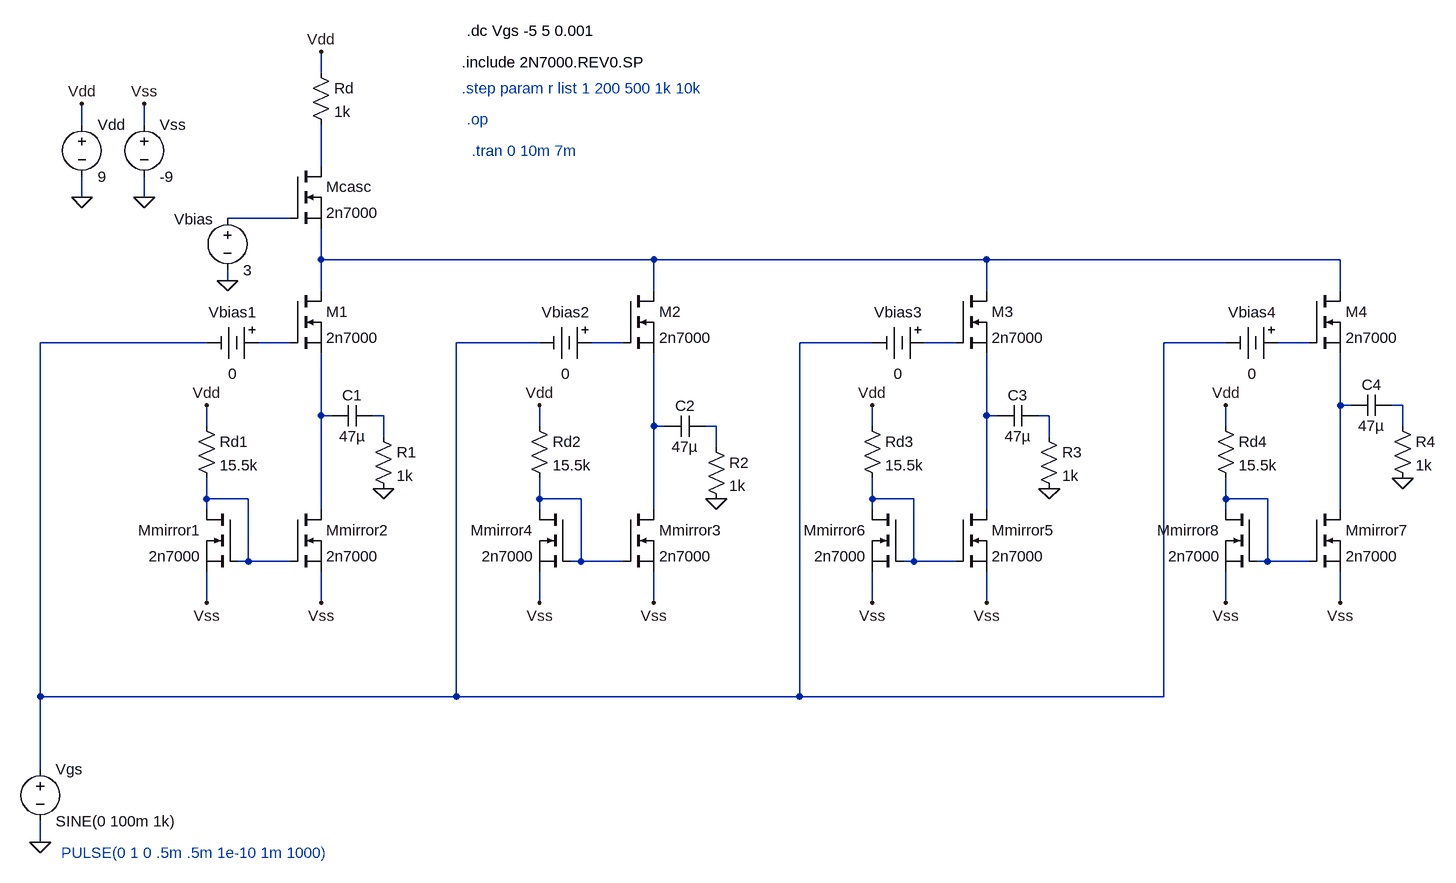
[diagram p0: schematic the circuit complete.asc]
the circuit complete.asc, the LTspice schematic file:
Version 4
SHEET 1 1940 1168
WIRE 208 -192 208 -224
WIRE -160 -112 -160 -144
WIRE -64 -112 -64 -144
WIRE 208 -48 208 -112
WIRE -160 0 -160 -32
WIRE -64 0 -64 -32
WIRE 160 32 64 32
WIRE 208 96 208 48
WIRE 720 96 208 96
WIRE 1232 96 720 96
WIRE 1776 96 1232 96
WIRE 64 128 64 112
WIRE 208 144 208 96
WIRE 720 144 720 96
WIRE 1232 144 1232 96
WIRE 1776 144 1776 96
WIRE 32 224 -224 224
WIRE 160 224 112 224
WIRE 544 224 416 224
WIRE 672 224 624 224
WIRE 1056 224 944 224
WIRE 1184 224 1136 224
WIRE 1600 224 1504 224
WIRE 1728 224 1680 224
WIRE 1776 320 1776 240
WIRE 1792 320 1776 320
WIRE 1872 320 1856 320
WIRE 208 336 208 240
WIRE 224 336 208 336
WIRE 304 336 288 336
WIRE 1232 336 1232 240
WIRE 1248 336 1232 336
WIRE 1328 336 1312 336
WIRE 32 352 32 320
WIRE 544 352 544 320
WIRE 720 352 720 240
WIRE 736 352 720 352
WIRE 816 352 800 352
WIRE 1056 352 1056 320
WIRE 1600 352 1600 320
WIRE 1872 352 1872 320
WIRE 304 368 304 336
WIRE 1328 368 1328 336
WIRE 816 384 816 352
WIRE 32 464 32 432
WIRE 96 464 32 464
WIRE 544 464 544 432
WIRE 608 464 544 464
WIRE 1056 464 1056 432
WIRE 1120 464 1056 464
WIRE 1600 464 1600 432
WIRE 1664 464 1600 464
WIRE 32 480 32 464
WIRE 208 480 208 336
WIRE 544 480 544 464
WIRE 720 480 720 352
WIRE 1056 480 1056 464
WIRE 1232 480 1232 336
WIRE 1600 480 1600 464
WIRE 1776 480 1776 320
WIRE 96 560 96 464
WIRE 96 560 80 560
WIRE 160 560 96 560
WIRE 608 560 608 464
WIRE 608 560 592 560
WIRE 672 560 608 560
WIRE 1120 560 1120 464
WIRE 1120 560 1104 560
WIRE 1184 560 1120 560
WIRE 1664 560 1664 464
WIRE 1664 560 1648 560
WIRE 1728 560 1664 560
WIRE 32 624 32 576
WIRE 208 624 208 576
WIRE 544 624 544 576
WIRE 720 624 720 576
WIRE 1056 624 1056 576
WIRE 1232 624 1232 576
WIRE 1600 624 1600 576
WIRE 1776 624 1776 576
WIRE -224 768 -224 224
WIRE 416 768 416 224
WIRE 416 768 -224 768
WIRE 944 768 944 224
WIRE 944 768 416 768
WIRE 1504 768 1504 224
WIRE 1504 768 944 768
WIRE -224 880 -224 768
WIRE -224 992 -224 960
FLAG -224 992 0
FLAG -160 0 0
FLAG -160 -144 Vdd
FLAG 208 -224 Vdd
FLAG 64 128 0
FLAG -64 0 0
FLAG -64 -144 Vss
FLAG 32 320 Vdd
FLAG 32 624 Vss
FLAG 208 624 Vss
FLAG 544 320 Vdd
FLAG 544 624 Vss
FLAG 720 624 Vss
FLAG 1056 320 Vdd
FLAG 1056 624 Vss
FLAG 1232 624 Vss
FLAG 1600 320 Vdd
FLAG 1600 624 Vss
FLAG 1776 624 Vss
FLAG 304 448 0
FLAG 816 464 0
FLAG 1328 448 0
FLAG 1872 432 0
SYMBOL nmos 160 144 R0
SYMATTR InstName M1
SYMATTR Value 2n7000
SYMATTR Prefix X
SYMBOL voltage -224 864 R0
WINDOW 123 0 0 Left 2
WINDOW 39 0 0 Left 2
SYMATTR InstName Vgs
SYMATTR Value SINE(0 100m 1k)
SYMBOL voltage -160 -128 R0
WINDOW 123 0 0 Left 2
WINDOW 39 0 0 Left 2
SYMATTR InstName Vdd
SYMATTR Value 9
SYMBOL res 192 -208 R0
SYMATTR InstName Rd
SYMATTR Value 1k
SYMBOL nmos 160 -48 R0
SYMATTR InstName Mcasc
SYMATTR Value 2n7000
SYMATTR Prefix X
SYMBOL voltage 64 16 R0
WINDOW 0 -82 18 Left 2
WINDOW 123 0 0 Left 2
WINDOW 39 0 0 Left 2
SYMATTR InstName Vbias
SYMATTR Value 3
SYMBOL battery 128 224 R90
WINDOW 0 -32 56 VBottom 2
WINDOW 3 32 56 VTop 2
SYMATTR InstName Vbias1
SYMATTR Value 0
SYMBOL nmos 160 480 R0
SYMATTR InstName Mmirror2
SYMATTR Value 2n7000
SYMATTR Prefix X
SYMBOL nmos 80 480 M0
SYMATTR InstName Mmirror1
SYMATTR Value 2n7000
SYMATTR Prefix X
SYMBOL voltage -64 -128 R0
WINDOW 123 0 0 Left 2
WINDOW 39 0 0 Left 2
SYMATTR InstName Vss
SYMATTR Value -9
SYMBOL res 16 336 R0
SYMATTR InstName Rd1
SYMATTR Value 15.5k
SYMBOL nmos 672 144 R0
SYMATTR InstName M2
SYMATTR Value 2n7000
SYMATTR Prefix X
SYMBOL battery 640 224 R90
WINDOW 0 -32 56 VBottom 2
WINDOW 3 32 56 VTop 2
SYMATTR InstName Vbias2
SYMATTR Value 0
SYMBOL nmos 672 480 R0
SYMATTR InstName Mmirror3
SYMATTR Value 2n7000
SYMATTR Prefix X
SYMBOL nmos 592 480 M0
SYMATTR InstName Mmirror4
SYMATTR Value 2n7000
SYMATTR Prefix X
SYMBOL res 528 336 R0
SYMATTR InstName Rd2
SYMATTR Value 15.5k
SYMBOL nmos 1184 144 R0
SYMATTR InstName M3
SYMATTR Value 2n7000
SYMATTR Prefix X
SYMBOL battery 1152 224 R90
WINDOW 0 -32 56 VBottom 2
WINDOW 3 32 56 VTop 2
SYMATTR InstName Vbias3
SYMATTR Value 0
SYMBOL nmos 1184 480 R0
SYMATTR InstName Mmirror5
SYMATTR Value 2n7000
SYMATTR Prefix X
SYMBOL nmos 1104 480 M0
SYMATTR InstName Mmirror6
SYMATTR Value 2n7000
SYMATTR Prefix X
SYMBOL res 1040 336 R0
SYMATTR InstName Rd3
SYMATTR Value 15.5k
SYMBOL nmos 1728 144 R0
SYMATTR InstName M4
SYMATTR Value 2n7000
SYMATTR Prefix X
SYMBOL battery 1696 224 R90
WINDOW 0 -32 56 VBottom 2
WINDOW 3 32 56 VTop 2
SYMATTR InstName Vbias4
SYMATTR Value 0
SYMBOL nmos 1728 480 R0
SYMATTR InstName Mmirror7
SYMATTR Value 2n7000
SYMATTR Prefix X
SYMBOL nmos 1648 480 M0
SYMATTR InstName Mmirror8
SYMATTR Value 2n7000
SYMATTR Prefix X
SYMBOL res 1584 336 R0
SYMATTR InstName Rd4
SYMATTR Value 15.5k
SYMBOL res 288 352 R0
SYMATTR InstName R1
SYMATTR Value 1k
SYMBOL cap 288 320 R90
WINDOW 0 0 32 VBottom 2
WINDOW 3 32 32 VTop 2
SYMATTR InstName C1
SYMATTR Value 47µ
SYMBOL res 800 368 R0
SYMATTR InstName R2
SYMATTR Value 1k
SYMBOL cap 800 336 R90
WINDOW 0 0 32 VBottom 2
WINDOW 3 32 32 VTop 2
SYMATTR InstName C2
SYMATTR Value 47µ
SYMBOL res 1312 352 R0
SYMATTR InstName R3
SYMATTR Value 1k
SYMBOL cap 1312 320 R90
WINDOW 0 0 32 VBottom 2
WINDOW 3 32 32 VTop 2
SYMATTR InstName C3
SYMATTR Value 47µ
SYMBOL res 1856 336 R0
SYMATTR InstName R4
SYMATTR Value 1k
SYMBOL cap 1856 304 R90
WINDOW 0 0 32 VBottom 2
WINDOW 3 32 32 VTop 2
SYMATTR InstName C4
SYMATTR Value 47µ
TEXT 432 -256 Left 2 !.dc Vgs -5 5 0.001
TEXT 424 -208 Left 2 !.include 2N7000.REV0.SP
TEXT 424 -168 Left 2 ;.step param r list 1 200 500 1k 10k
TEXT 432 -120 Left 2 ;.op
TEXT 440 -72 Left 2 ;.tran 0 10m 7m
TEXT -192 1008 Left 2 ;PULSE(0 1 0 .5m .5m 1e-10 1m 1000)

The netlist it stands for:
* the circuit complete.asc
XM1 N003 N005 N011 2n7000  ; pins D G S
Vgs N004 0 SINE(0 100m 1k)
Vdd Vdd 0 9
Rd Vdd N001 1k
XMcasc N001 N002 N003 2n7000  ; pins D G S
Vbias N002 0 3
Vbias1 N005 N004 0
XMmirror2 N011 N017 Vss 2n7000  ; pins D G S
XMmirror1 N017 N017 Vss 2n7000  ; pins D G S
Vss Vss 0 -9
Rd1 Vdd N017 15.5k
XM2 N003 N006 N015 2n7000  ; pins D G S
Vbias2 N006 N004 0
XMmirror3 N015 N018 Vss 2n7000  ; pins D G S
XMmirror4 N018 N018 Vss 2n7000  ; pins D G S
Rd2 Vdd N018 15.5k
XM3 N003 N007 N013 2n7000  ; pins D G S
Vbias3 N007 N004 0
XMmirror5 N013 N019 Vss 2n7000  ; pins D G S
XMmirror6 N019 N019 Vss 2n7000  ; pins D G S
Rd3 Vdd N019 15.5k
XM4 N003 N008 N009 2n7000  ; pins D G S
Vbias4 N008 N004 0
XMmirror7 N009 N020 Vss 2n7000  ; pins D G S
XMmirror8 N020 N020 Vss 2n7000  ; pins D G S
Rd4 Vdd N020 15.5k
R1 N012 0 1k
C1 N012 N011 47µ
R2 N016 0 1k
C2 N016 N015 47µ
R3 N014 0 1k
C3 N014 N013 47µ
R4 N010 0 1k
C4 N010 N009 47µ
.dc Vgs -5 5 0.001
.include 2N7000.REV0.SP
* .step param r list 1 200 500 1k 10k
* .op
* .tran 0 10m 7m
* PULSE(0 1 0 .5m .5m 1e-10 1m 1000)
.backanno
.end